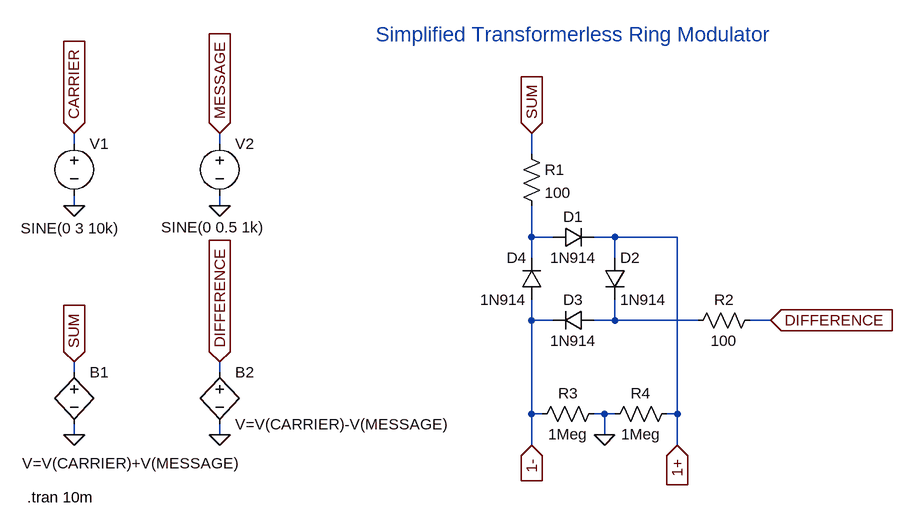
[diagram p0: schematic simplified_ring_mod.asc]
simplified_ring_mod.asc, the LTspice schematic file:
Version 4
SHEET 1 1540 680
WIRE 256 -48 256 -64
WIRE 480 -48 480 -64
WIRE 960 -32 960 -64
WIRE 256 48 256 32
WIRE 480 48 480 32
WIRE 960 96 960 48
WIRE 992 96 960 96
WIRE 1088 96 1056 96
WIRE 1184 96 1088 96
WIRE 960 128 960 96
WIRE 1088 128 1088 96
WIRE 960 224 960 192
WIRE 992 224 960 224
WIRE 1088 224 1088 192
WIRE 1088 224 1056 224
WIRE 1216 224 1088 224
WIRE 1328 224 1296 224
WIRE 256 304 256 288
WIRE 480 304 480 288
WIRE 960 368 960 224
WIRE 976 368 960 368
WIRE 1072 368 1056 368
WIRE 1088 368 1072 368
WIRE 1184 368 1184 96
WIRE 1184 368 1168 368
WIRE 256 400 256 384
WIRE 480 400 480 384
WIRE 1072 400 1072 368
WIRE 960 416 960 368
WIRE 1184 416 1184 368
FLAG 256 -64 CARRIER
IOPIN 256 -64 In
FLAG 480 -64 MESSAGE
IOPIN 480 -64 In
FLAG 256 48 0
FLAG 480 48 0
FLAG 256 288 SUM
IOPIN 256 288 In
FLAG 480 288 DIFFERENCE
IOPIN 480 288 In
FLAG 256 400 0
FLAG 480 400 0
FLAG 1072 400 0
FLAG 960 -64 SUM
IOPIN 960 -64 In
FLAG 1328 224 DIFFERENCE
IOPIN 1328 224 In
FLAG 960 416 1-
IOPIN 960 416 In
FLAG 1184 416 1+
IOPIN 1184 416 In
SYMBOL voltage 256 -64 R0
WINDOW 3 -82 146 Left 2
WINDOW 123 0 0 Left 0
WINDOW 39 0 0 Left 0
SYMATTR Value SINE(0 3 10k)
SYMATTR InstName V1
SYMBOL voltage 480 -64 R0
WINDOW 3 -90 145 Left 2
WINDOW 123 0 0 Left 0
WINDOW 39 0 0 Left 0
SYMATTR Value SINE(0 0.5 1k)
SYMATTR InstName V2
SYMBOL bv 256 288 R0
WINDOW 3 -80 156 Left 2
SYMATTR Value V=V(CARRIER)+V(MESSAGE)
SYMATTR InstName B1
SYMBOL bv 480 288 R0
SYMATTR InstName B2
SYMATTR Value V=V(CARRIER)-V(MESSAGE)
SYMBOL res 944 -48 R0
SYMATTR InstName R1
SYMATTR Value 100
SYMBOL diode 992 112 R270
WINDOW 0 32 32 VTop 2
WINDOW 3 0 32 VBottom 2
SYMATTR InstName D1
SYMATTR Value 1N914
SYMBOL diode 1072 128 R0
SYMATTR InstName D2
SYMATTR Value 1N914
SYMBOL diode 1056 208 R90
WINDOW 0 0 32 VBottom 2
WINDOW 3 32 32 VTop 2
SYMATTR InstName D3
SYMATTR Value 1N914
SYMBOL diode 976 192 R180
WINDOW 0 24 64 Left 2
WINDOW 3 24 0 Left 2
SYMATTR InstName D4
SYMATTR Value 1N914
SYMBOL res 1312 208 R90
WINDOW 0 0 56 VBottom 2
WINDOW 3 32 56 VTop 2
SYMATTR InstName R2
SYMATTR Value 100
SYMBOL res 1072 352 R90
WINDOW 0 0 56 VBottom 2
WINDOW 3 32 56 VTop 2
SYMATTR InstName R3
SYMATTR Value 1Meg
SYMBOL res 1184 352 R90
WINDOW 0 0 56 VBottom 2
WINDOW 3 32 56 VTop 2
SYMATTR InstName R4
SYMATTR Value 1Meg
TEXT 184 496 Left 2 !.tran 10m
TEXT 720 -216 Left 3 ;Simplified Transformerless Ring Modulator

The netlist it stands for:
* simplified_ring_mod.asc
V1 CARRIER 0 SINE(0 3 10k)
V2 MESSAGE 0 SINE(0 0.5 1k)
B1 SUM 0 V=V(CARRIER)+V(MESSAGE)
B2 DIFFERENCE 0 V=V(CARRIER)-V(MESSAGE)
R1 SUM N001 100
D1 N001 1+ 1N914
D2 1+ N002 1N914
D3 N002 1- 1N914
D4 1- N001 1N914
R2 DIFFERENCE N002 100
R3 0 1- 1Meg
R4 1+ 0 1Meg
.model D D
.lib standard.dio
.tran 10m
* Simplified Transformerless Ring Modulator
.backanno
.end